# Altium schematic sheet MCU.SchDoc
size 279 x 215 mm
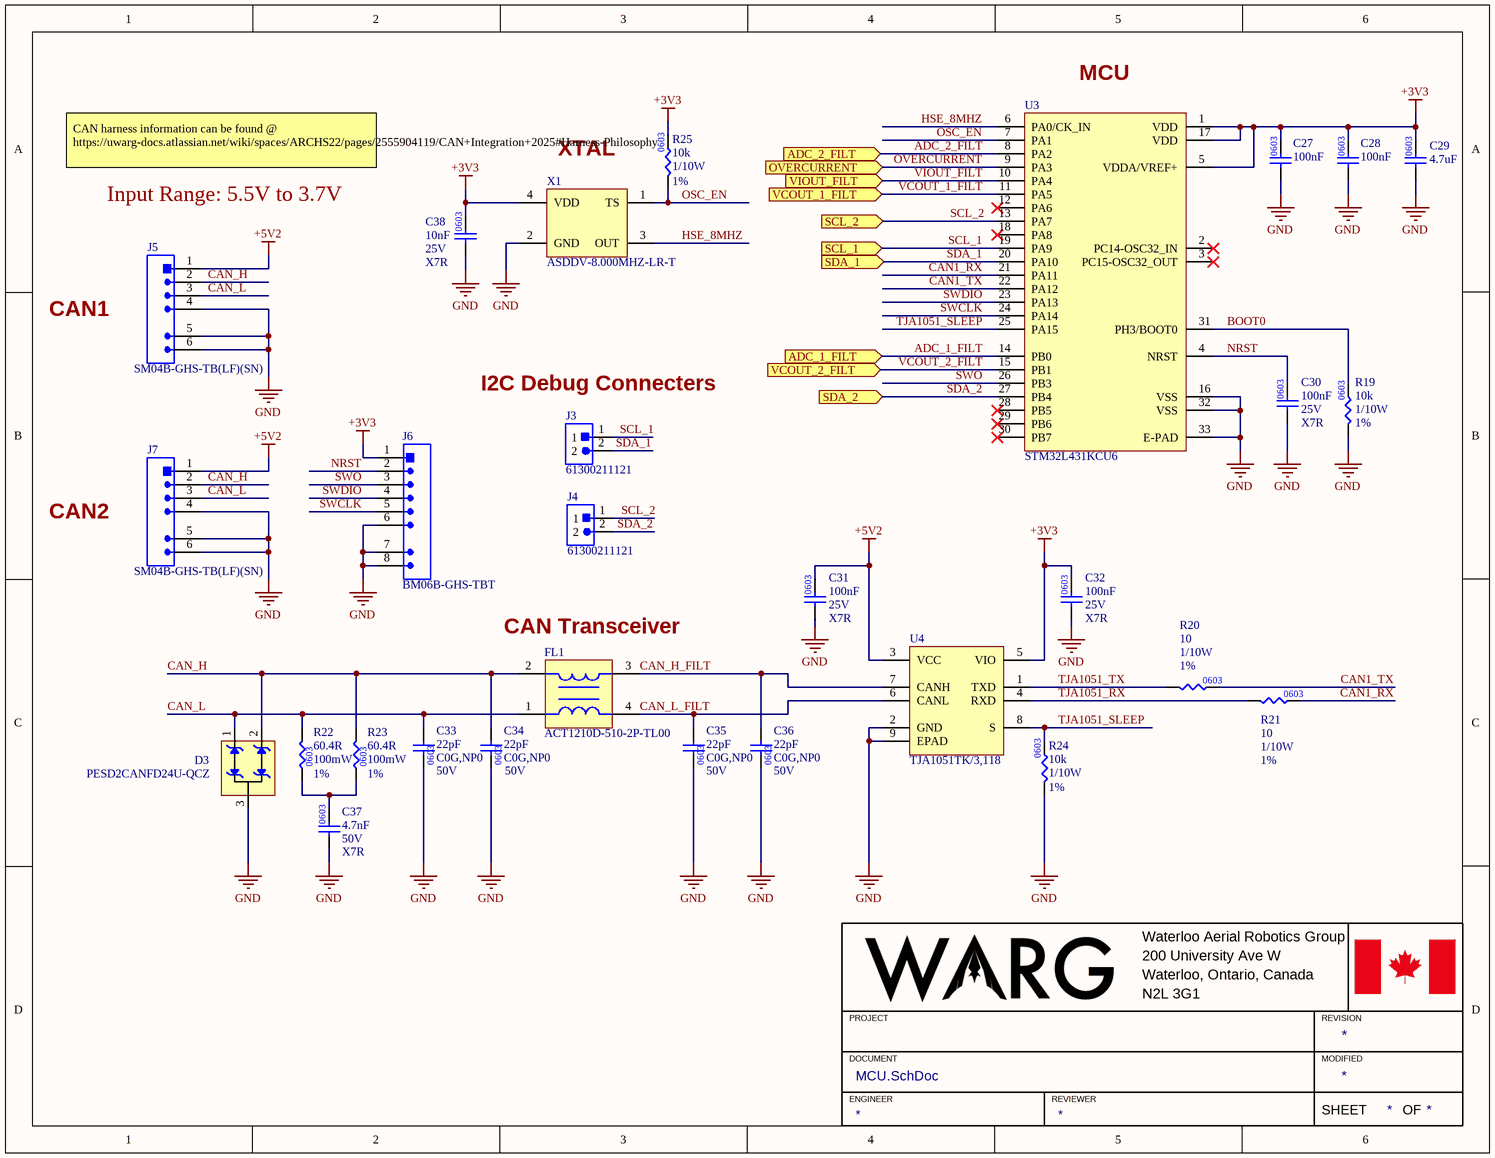
[diagram p0: MCU.SchDoc]

## Parts
C27  value 100nF  [.CAP_0603-Footprint-1]  (hidden comment: GCM188R71C104KA37D)
C28  value 100nF  [.CAP_0603-Footprint-1]  (hidden comment: GCM188R71C104KA37D)
C29  value 4.7uF  [.CAP_0603-Footprint-1]  (hidden comment: GRM188C81E475KE11D)
C30  Voltage Rating: 25V  Dielectric: X7R  Capacitance: 100nF  [.CAP_0603-Footprint-1]  (hidden comment: CL10B104KA8NNNC)
C31  Voltage Rating: 25V  Dielectric: X7R  Capacitance: 100nF  [.CAP_0603-Footprint-1]  (hidden comment: CL10B104KA8NNNC)
C32  Voltage Rating: 25V  Dielectric: X7R  Capacitance: 100nF  [.CAP_0603-Footprint-1]  (hidden comment: CL10B104KA8NNNC)
C33  value 22pF  Temperature Coefficient: C0G,NP0  Voltage Rating: 50V  [.CAP_0603-Footprint-1]  (hidden comment: CC0603JRNPO9BN220)
C34  value 22pF  Temperature Coefficient: C0G,NP0  Voltage Rating: 50V  [.CAP_0603-Footprint-1]  (hidden comment: CC0603JRNPO9BN220)
C35  value 22pF  Temperature Coefficient: C0G,NP0  Voltage Rating: 50V  [.CAP_0603-Footprint-1]  (hidden comment: CC0603JRNPO9BN220)
C36  value 22pF  Temperature Coefficient: C0G,NP0  Voltage Rating: 50V  [.CAP_0603-Footprint-1]  (hidden comment: CC0603JRNPO9BN220)
C37  value 4.7nF  Rated DC Voltage (URdc): 50V  Temperature Characteristics Code: X7R  [.CAP_0603-Footprint-1]  (hidden comment: GCM188R71H472KA37D)
C38  Temperature Coefficient: X7R  Voltage Rating: 25V  Capacitance: 10nF  [.CAP_0603-Footprint-1]  (hidden comment: CC0603KRX7R8BB103)
D3  PESD2CANFD24U-QCZ  [PESD2CANFD24U-QCZ-Footprint-1]
FL1  ACT1210D-510-2P-TL00  [ACT1210D-510-2P-TL00-Footprint-1]
J3  61300211121  [61300211121]
J4  61300211121  [61300211121]
J5  SM04B-GHS-TB(LF)(SN)  [CONN_SM04B-GHS-TB_JST]
J6  BM06B-GHS-TBT  [BM06B-GHS-TBT-Footprint-1]
J7  SM04B-GHS-TB(LF)(SN)  [CONN_SM04B-GHS-TB_JST]
R19  value 10k  Power: 1/10W  Tolerance: 1%  [.RES_0603-Footprint-1]  (hidden comment: RC0603FR-0710KL)
R20  value 10  Power: 1/10W  Tolerance: 1%  [.RES_0603-Footprint-1]  (hidden comment: RC0603FR-0710RL)
R21  value 10  Power: 1/10W  Tolerance: 1%  [.RES_0603-Footprint-1]  (hidden comment: RC0603FR-0710RL)
R22  value 60.4R  Tolerance: 1%  Power: 100mW  [RES0603]  (hidden comment: RC0603FR-1360R4L)
R23  value 60.4R  Tolerance: 1%  Power: 100mW  [RES0603]  (hidden comment: RC0603FR-1360R4L)
R24  value 10k  Power: 1/10W  Tolerance: 1%  [.RES_0603-Footprint-1]  (hidden comment: RC0603FR-0710KL)
R25  value 10k  Power: 1/10W  Tolerance: 1%  [.RES_0603-Footprint-1]  (hidden comment: RC0603FR-0710KL)
U3  STM32L431KCU6  [STM32L431KCU6-Footprint-1]
U4  TJA1051TK/3,118  [TJA1051TK_3,118-Footprint-1]
X1  ASDDV-8.000MHZ-LR-T  [ASDDV-8.000MHZ-LR-T-Footprint-1]

## Ports
ADC_1_FILT (in), ADC_2_FILT (in), OVERCURRENT (in), SCL_1 (in), SCL_2 (in), SDA_1 (in), SDA_2 (in), VCOUT_1_FILT (in), VCOUT_2_FILT (in), VIOUT_FILT (in)

## Nets
+3V3: C27.2 C28.2 C29.2 C32.2 C38.2 J6.1 R25.2 U3.1(VDD) U3.5(VDDA/VREF+) U3.17(VDD) U4.5(VIO) X1.4(VDD)
+5V2: C31.2 J5.1 J7.1 U4.3(VCC)
GND: C27.1 C28.1 C29.1 C30.1 C31.1 C32.1 C33.1 C34.1 C35.1 C36.1 C37.1 C38.1 D3.3(CC) J5.4 J5.5 J5.6 J6.6 J6.7 J6.8 J7.4 J7.5 J7.6 R19.1 R24.1 U3.16(VSS) U3.32(VSS) U3.33(E-PAD) U4.2(GND) U4.9(EPAD) X1.2(GND)
ADC_1_FILT: U3.14(PB0) ; port ADC_1_FILT
ADC_2_FILT: U3.8(PA2) ; port ADC_2_FILT
BOOT0: R19.2 U3.31(PH3/BOOT0)
CAN1_RX: R21.2 U3.21(PA11)
CAN1_TX: R20.2 U3.22(PA12)
CAN_H: C34.2 D3.2(K2) FL1.2 J5.2 J7.2 R23.2
CAN_H_FILT: C36.2 FL1.3 U4.7(CANH)
CAN_L: C33.2 D3.1(K1) FL1.1 J5.3 J7.3 R22.2
CAN_L_FILT: C35.2 FL1.4 U4.6(CANL)
HSE_8MHZ: U3.6(PA0/CK_IN) X1.3(OUT)
NRST: C30.2 J6.2 U3.4(NRST)
OSC_EN: R25.1 U3.7(PA1) X1.1(TS)
OVERCURRENT: U3.9(PA3) ; port OVERCURRENT
SCL_1: J3.1 U3.19(PA9) ; port SCL_1
SCL_2: J4.1 U3.13(PA7) ; port SCL_2
SDA_1: J3.2 U3.20(PA10) ; port SDA_1
SDA_2: J4.2 U3.27(PB4) ; port SDA_2
SWCLK: J6.5 U3.24(PA14)
SWDIO: J6.4 U3.23(PA13)
SWO: J6.3 U3.26(PB3)
TJA1051_RX: R21.1 U4.4(RXD)
TJA1051_SLEEP: R24.2 U3.25(PA15) U4.8(S)
TJA1051_TX: R20.1 U4.1(TXD)
VCOUT_1_FILT: U3.11(PA5) ; port VCOUT_1_FILT
VCOUT_2_FILT: U3.15(PB1) ; port VCOUT_2_FILT
VIOUT_FILT: U3.10(PA4) ; port VIOUT_FILT
NetC37_2: C37.2 R22.1 R23.1

Not connected (* = marked no-connect by the designer): U3 2(PC14-OSC32_IN)* 3(PC15-OSC32_OUT)* 12(PA6)* 18(PA8)* 28(PB5)* 29(PB6)* 30(PB7)*

## Notes on the sheet
- (near U3) MCU
- CAN harness information can be found @ https://uwarg-docs.atlassian.net/wiki/spaces/ARCHS22/pages/2555904119/CAN+Integration+2025#Harness-Philosophy
- XTAL
- Input Range: 5.5V to 3.7V
- CAN1
- (near J3) I2C Debug Connecters
- CAN2
- (near FL1) CAN Transceiver
- Waterloo Aerial Robotics Group
- 200 University Ave W
- PROJECT
- Waterloo, Ontario, Canada
- N2L 3G1
- REVISION
- DOCUMENT
- ENGINEER
- REVIEWER
- MODIFIED
- SHEET
- OF
- (in symbol CMP-00245-1) 0603

## Library data of the parts
C27 C28 = CMP-001-00003-8: CAP CER 100nF 16V X7R 0603; Capacitance: 100nF; Package: 0603; Voltage: 16V
C29 = CMP-001-00002-10: CAP CER 4.7uF 25V X6S 0603; Voltage: 25V; Capacitance: 4.7uF; Dielectric: X6S; Package: 0603
C30-C32 = CMP-00057-2: CAP CER 0.1UF 25V X7R 0603; Tolerance: 10%; Case/Package: 0603
C33-C36 = CMP-00246-2: CAP CER 22PF 50V C0G/NPO 0603; Tolerance: 5%; Case/Package: 0603
C37 = CMP-001-00080-1: CAP CER 4700PF 50V X7R 0603; Tolerance (fill in as +-): 10%; Multilayer: Yes; Capacitor Type: Ceramic; Reference Standard: AEC-Q200; Pins: 2; Package Shape: Rectangular; Reach SVHC Compliant: Yes; RoHS Compliant: Yes; Height: 0.9mm; Terminal Finish: Nickel; Termination: Wraparound; Width: 0.8mm; Mounting Technology: Surface Mount; JESD-609 Code: e3; Package Style: SMTMeter; Length: 1.6mm; Packaging: Tape and Reel; Tolerance  (fill in as +-): 10%; Case/Package: 0603; Max Operating Temperature: 125°C; Min Operating Temperature: -55°C; Dielectric Material: Ceramic
C38 = CMP-00217-1: CAP CER 10nF 25V X7R 0603; Package: 0603
D3 = CMP-00239-5: TVS DIODE 24VWM 43VC DFN1412D-3
FL1 = CMP-00243-2: CMC 50UH 115MA 2LN 2.3KOHM SMD
J3 J4 = CMP-00165-2: CONN HEADER VERT 2POS 2.54MM; Operating Temperature Range: -40°C ~ 105°C; Mounting Type: TH
J5 J7 = CMP-068-000000-3: Conn Shrouded Header HDR 4 POS 1.25mm Solder RA SMD Reel; Mfr_Name: JST; Source: SM04B-GHS-TB_LF__SN_.SchLib; RefDes: RefDes; Design Item ID: SM04B-GHS-TB(LF)(SN); Type: Type
J6 = CMP-002-00014-7: Connector Header Surface Mount 6 position 0.049" (1.25mm); Mfr Name: JST; Design Item ID: BM06B-GHS-TBT
R19 R24 R25 = CMP-009-00006-4: RES 10K OHM 1% 1/10W 0603; Resistance: 10k; Package: 0603
R20 R21 = CMP-009-00084-1: RES 10 OHM 1% 1/10W 0603; Resistance: 10; Package: 0603
R22 R23 = CMP-00245-1: RES 60.4 OHM 1% 1/10W 0603
U3 = CMP-00224-5: IC MCU 32BIT 256KB FLSH 32UFQFPN
U4 = CMP-00219-3: IC TRANSCEIVER HALF 1/1 8HVSON
X1 = CMP-00242-3: OSC XO 8.000MHZ CMOS SMD; Frequence Stability: 25ppm; Frequency: 8MHz